# Altium schematic sheet uart.SchDoc
size A3
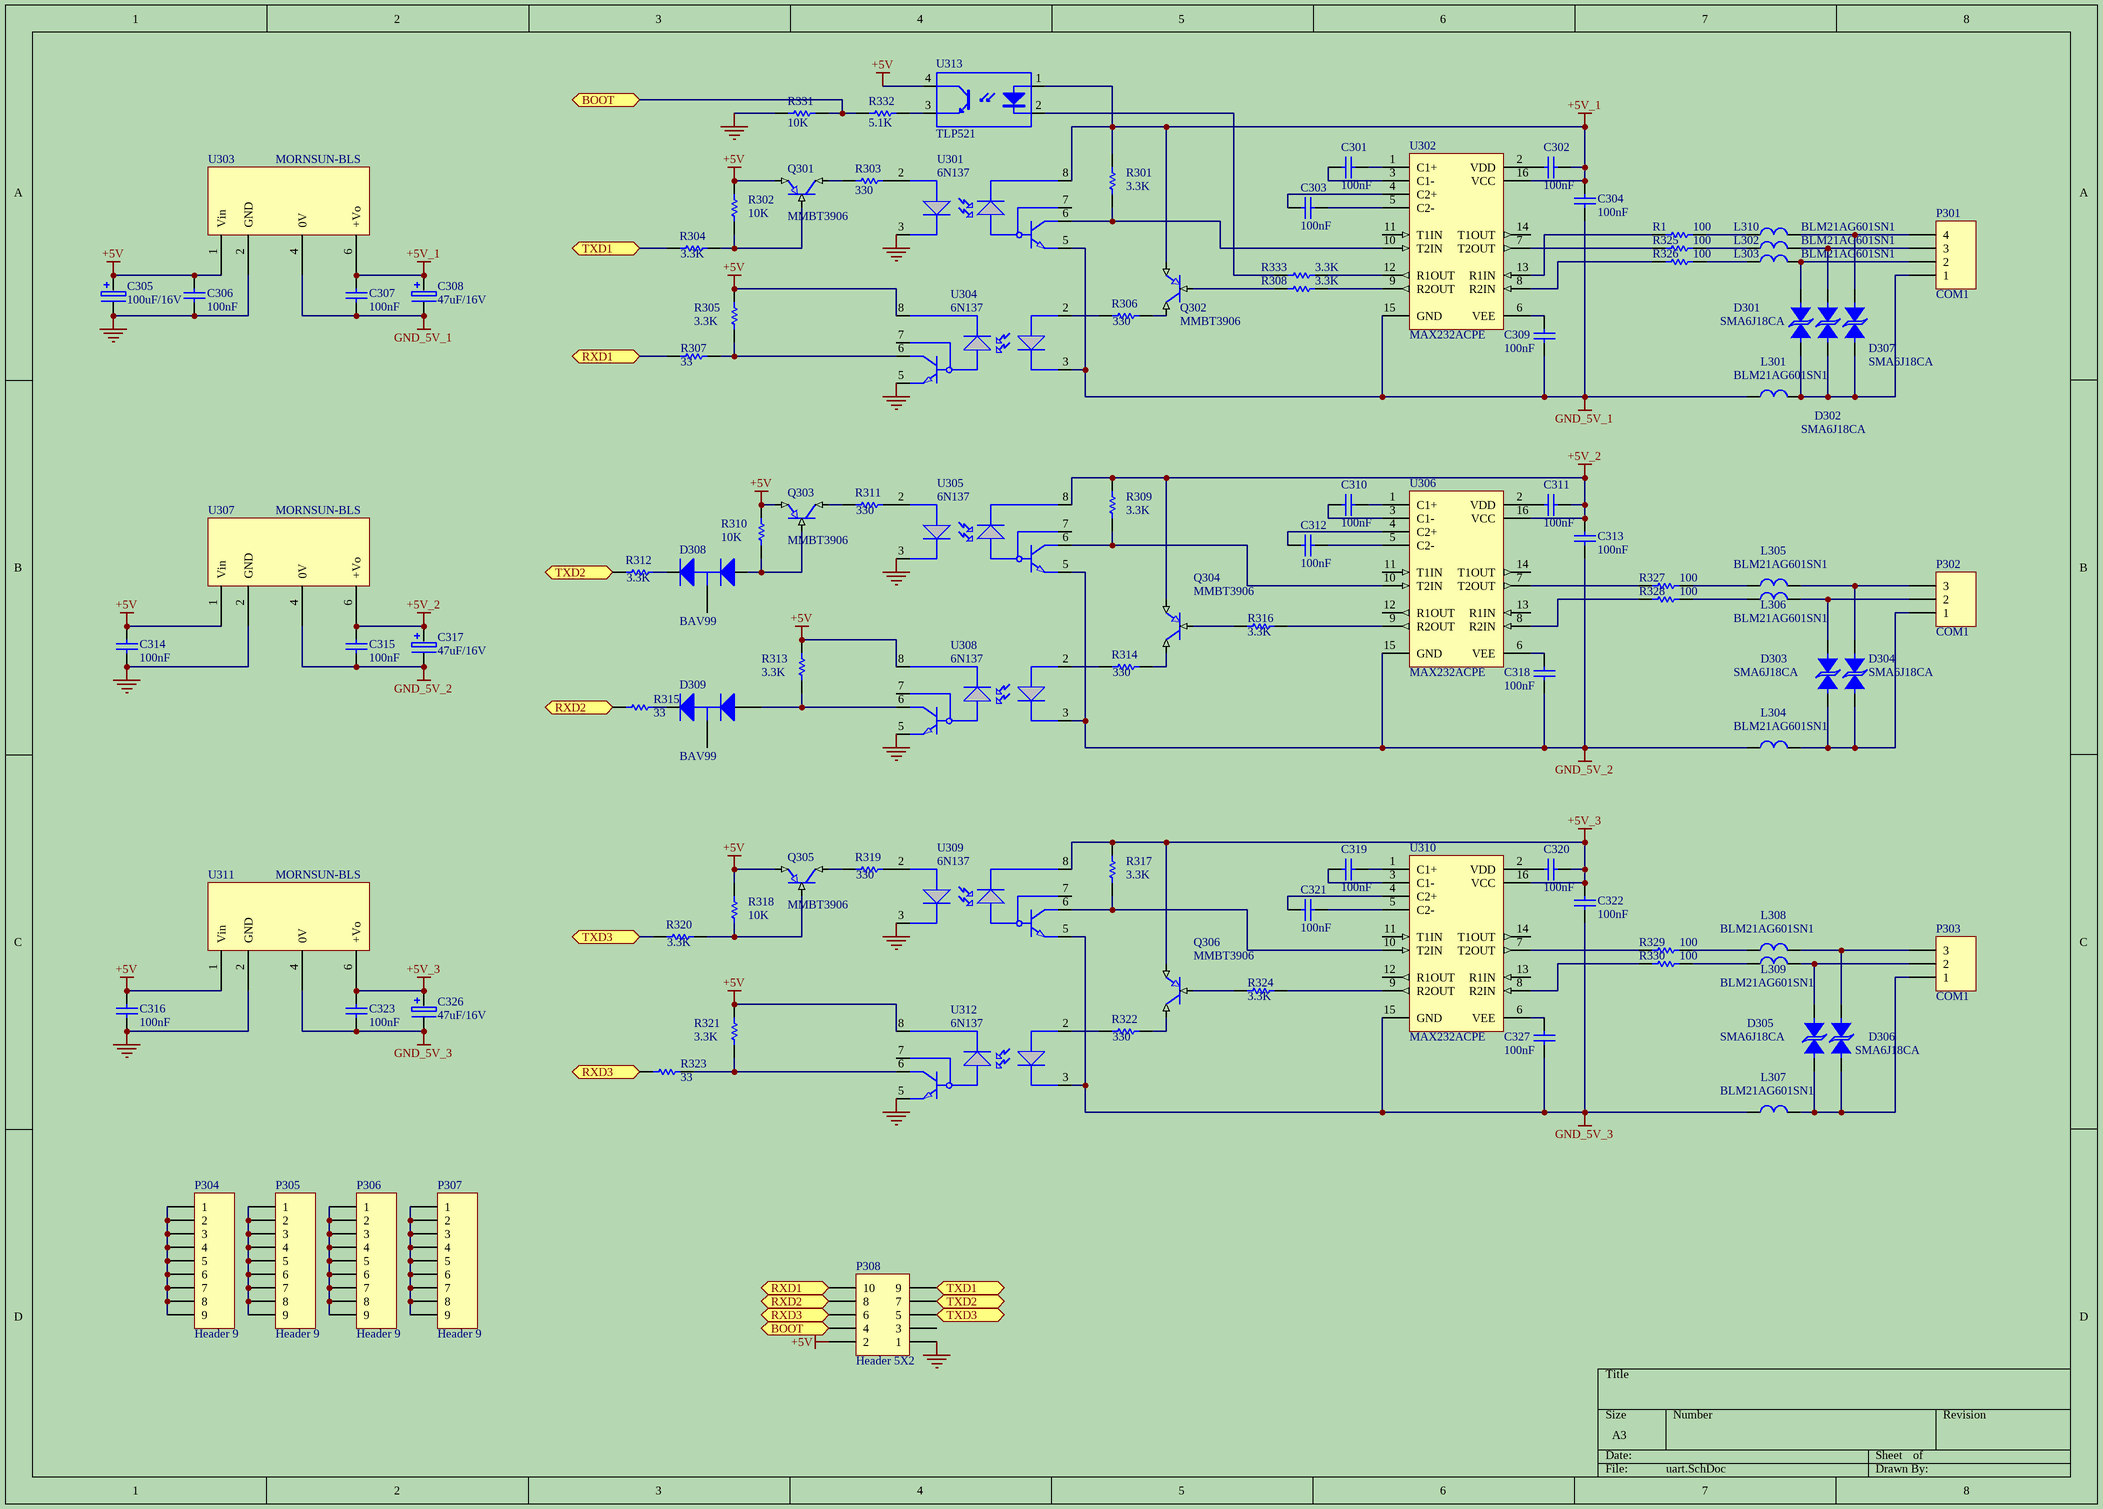
[diagram p0: uart.SchDoc]

## Parts
C301  100nF  [C0805]
C302  100nF  [C0805]
C303  100nF  [C0805]
C304  100nF  [C0805]
C305  100uF/16V  [CD1/2]
C306  100nF  [C0805]
C307  100nF  [C0805]
C308  47uF/16V  [CD1/2]
C309  100nF  [C0805]
C310  100nF  [C0805]
C311  100nF  [C0805]
C312  100nF  [C0805]
C313  100nF  [C0805]
C314  100nF  [C0805]
C315  100nF  [C0805]
C316  100nF  [C0805]
C317  47uF/16V  [CD1/2]
C318  100nF  [C0805]
C319  100nF  [C0805]
C320  100nF  [C0805]
C321  100nF  [C0805]
C322  100nF  [C0805]
C323  100nF  [C0805]
C326  47uF/16V  [CD1/2]
C327  100nF  [C0805]
D301  SMA6J18CA  [SMA]
D302  SMA6J18CA  [SMA]
D303  SMA6J18CA  [SMA]
D304  SMA6J18CA  [SMA]
D305  SMA6J18CA  [SMA]
D306  SMA6J18CA  [SMA]
D307  SMA6J18CA  [SMA]
D308  BAV99  [SOT-23]
D309  BAV99  [SOT-23]
L301  BLM21AG601SN1  [L0805]
L302  BLM21AG601SN1  [L0805]
L303  BLM21AG601SN1  [L0805]
L304  BLM21AG601SN1  [L0805]
L305  BLM21AG601SN1  [L0805]
L306  BLM21AG601SN1  [L0805]
L307  BLM21AG601SN1  [L0805]
L308  BLM21AG601SN1  [L0805]
L309  BLM21AG601SN1  [L0805]
L310  BLM21AG601SN1  [L0805]
P301  COM1  [TJC3-4A]
P302  COM1  [TJC3-3A]
P303  COM1  [TJC3-3A]
P304  Header 9  [LK]
P305  Header 9  [LK]
P306  Header 9  [LK]
P307  Header 9  [LK]
P308  Header 5X2  [IDC10-EJ]
Q301  MMBT3906  [SOT-23]
Q302  MMBT3906  [SOT-23]
Q303  MMBT3906  [SOT-23]
Q304  MMBT3906  [SOT-23]
Q305  MMBT3906  [SOT-23]
Q306  MMBT3906  [SOT-23]
R1  100  [R0805]
R301  3.3K  [R0805]
R302  10K  [R0805]
R303  330  [R0805]
R304  3.3K  [R0805]
R305  3.3K  [R0805]
R306  330  [R0805]
R307  33  [R0805]
R308  3.3K  [R0805]
R309  3.3K  [R0805]
R310  10K  [R0805]
R311  330  [R0805]
R312  3.3K  [R0805]
R313  3.3K  [R0805]
R314  330  [R0805]
R315  33  [R0805]
R316  3.3K  [R0805]
R317  3.3K  [R0805]
R318  10K  [R0805]
R319  330  [R0805]
R320  3.3K  [R0805]
R321  3.3K  [R0805]
R322  330  [R0805]
R323  33  [R0805]
R324  3.3K  [R0805]
R325  100  [R0805]
R326  100  [R0805]
R327  100  [R0805]
R328  100  [R0805]
R329  100  [R0805]
R330  100  [R0805]
R331  10K  [R0805]
R332  5.1K  [R0805]
R333  3.3K  [R0805]
U301  6N137  [DIP8]
U302  MAX232ACPE  [PE16A]
U303  MORNSUN-BLS  [MORNSUN-BLS]
U304  6N137  [DIP8]
U305  6N137  [DIP8]
U306  MAX232ACPE  [PE16A]
U307  MORNSUN-BLS  [MORNSUN-BLS]
U308  6N137  [DIP8]
U309  6N137  [DIP8]
U310  MAX232ACPE  [PE16A]
U311  MORNSUN-BLS  [MORNSUN-BLS]
U312  6N137  [DIP8]
U313  TLP521  [DIP4]

## Ports
BOOT, RXD1, RXD2, RXD3, TXD1, TXD2, TXD3

## Nets
+5V: C305.1 C306.1 C314.1 C316.1 P308.2 Q301.2(E) Q303.2(E) Q305.2(E) R302.2 R305.2 R310.2 R313.2 R318.2 R321.2 U303.1(Vin) U304.8 U307.1(Vin) U308.8 U311.1(Vin) U312.8 U313.4(C)
+5V_1: C302.1 C304.1 C307.1 C308.1 Q302.2(E) R301.1 U301.8 U302.16(VCC) U303.6(+Vo) U313.1(A)
+5V_2: C311.1 C313.1 C315.1 C317.1 Q304.2(E) R309.1 U305.8 U306.16(VCC) U307.6(+Vo)
+5V_3: C320.1 C322.1 C323.1 C326.1 Q306.2(E) R317.1 U309.8 U310.16(VCC) U311.6(+Vo)
GND: C305.2 C306.2 C314.2 C316.2 P308.1 R331.1 U301.3 U303.2(GND) U304.5 U305.3 U307.2(GND) U308.5 U309.3 U311.2(GND) U312.5
GND_5V_1: C304.2 C307.2 C308.2 C309.1 L301.1 U301.5 U302.15(GND) U303.4(0V) U304.3
GND_5V_2: C313.2 C315.2 C317.2 C318.1 L304.1 U305.5 U306.15(GND) U307.4(0V) U308.3
GND_5V_3: C322.2 C323.2 C326.2 C327.1 L307.1 U309.5 U310.15(GND) U311.4(0V) U312.3
BOOT: P308.4 R331.2 R332.1 ; port BOOT
RXD1: P308.10 R307.2 ; port RXD1
RXD2: P308.8 R315.2 ; port RXD2
RXD3: P308.6 R323.2 ; port RXD3
TXD1: P308.9 R304.1 ; port TXD1
TXD2: P308.7 R312.1 ; port TXD2
TXD3: P308.5 R320.1 ; port TXD3
NetC301_1: C301.1 U302.1(C1+)
NetC301_2: C301.2 U302.3(C1-)
NetC302_2: C302.2 U302.2(VDD)
NetC303_1: C303.1 U302.5(C2-)
NetC303_2: C303.2 U302.4(C2+)
NetC309_2: C309.2 U302.6(VEE)
NetC310_1: C310.1 U306.1(C1+)
NetC310_2: C310.2 U306.3(C1-)
NetC311_2: C311.2 U306.2(VDD)
NetC312_1: C312.1 U306.5(C2-)
NetC312_2: C312.2 U306.4(C2+)
NetC318_2: C318.2 U306.6(VEE)
NetC319_1: C319.1 U310.1(C1+)
NetC319_2: C319.2 U310.3(C1-)
NetC320_2: C320.2 U310.2(VDD)
NetC321_1: C321.1 U310.5(C2-)
NetC321_2: C321.2 U310.4(C2+)
NetC327_2: C327.2 U310.6(VEE)
NetD301_1: D301.1(ANODE) D302.1(ANODE) D307.1(ANODE) L301.2 P301.1
NetD301_2: D301.2(CATHODE) L303.2 P301.2
NetD302_2: D302.2(CATHODE) L302.2 P301.3
NetD303_1: D303.1(ANODE) D304.1(ANODE) L304.2 P302.1
NetD303_2: D303.2(CATHODE) L306.2 P302.2
NetD304_2: D304.2(CATHODE) L305.2 P302.3
NetD305_1: D305.1(ANODE) D306.1(ANODE) L307.2 P303.1
NetD305_2: D305.2(CATHODE) L309.2 P303.2
NetD306_2: D306.2(CATHODE) L308.2 P303.3
NetD307_2: D307.2(CATHODE) L310.2 P301.4
NetD308_1: D308.1(A) Q303.1(B) R310.1
NetD308_2: D308.2(K) R312.2
NetD309_1: D309.1(A) R313.1 U308.6
NetD309_2: D309.2(K) R315.1
NetL302_1: L302.1 R325.1
NetL303_1: L303.1 R326.1
NetL305_1: L305.1 R327.1
NetL306_1: L306.1 R328.1
NetL308_1: L308.1 R329.1
NetL309_1: L309.1 R330.1
NetL310_1: L310.1 R1.1
NetP304_1: P304.1 P304.2 P304.3 P304.4 P304.5 P304.6 P304.7 P304.8 P304.9
NetP305_1: P305.1 P305.2 P305.3 P305.4 P305.5 P305.6 P305.7 P305.8 P305.9
NetP306_1: P306.1 P306.2 P306.3 P306.4 P306.5 P306.6 P306.7 P306.8 P306.9
NetP307_1: P307.1 P307.2 P307.3 P307.4 P307.5 P307.6 P307.7 P307.8 P307.9
NetQ301_1: Q301.1(B) R302.1 R304.2
NetQ301_3: Q301.3(C) R303.1
NetQ302_1: Q302.1(B) R308.1
NetQ302_3: Q302.3(C) R306.1
NetQ303_3: Q303.3(C) R311.2
NetQ304_1: Q304.1(B) R316.1
NetQ304_3: Q304.3(C) R314.1
NetQ305_1: Q305.1(B) R318.1 R320.2
NetQ305_3: Q305.3(C) R319.2
NetQ306_1: Q306.1(B) R324.1
NetQ306_3: Q306.3(C) R322.1
NetR1_2: R1.2 U302.13(R1IN)
NetR301_2: R301.2 U301.6 U302.10(T2IN)
NetR303_2: R303.2 U301.2
NetR305_1: R305.1 R307.1 U304.6
NetR306_2: R306.2 U304.2
NetR308_2: R308.2 U302.9(R2OUT)
NetR309_2: R309.2 U305.6 U306.10(T2IN)
NetR311_1: R311.1 U305.2
NetR314_2: R314.2 U308.2
NetR316_2: R316.2 U306.9(R2OUT)
NetR317_2: R317.2 U309.6 U310.10(T2IN)
NetR319_1: R319.1 U309.2
NetR321_1: R321.1 R323.1 U312.6
NetR322_2: R322.2 U312.2
NetR324_2: R324.2 U310.9(R2OUT)
NetR325_2: R325.2 U302.7(T2OUT)
NetR326_2: R326.2 U302.8(R2IN)
NetR327_2: R327.2 U306.7(T2OUT)
NetR328_2: R328.2 U306.8(R2IN)
NetR329_2: R329.2 U310.7(T2OUT)
NetR330_2: R330.2 U310.8(R2IN)
NetR332_2: R332.2 U313.3(E)
NetR333_1: R333.1 U313.2(K)
NetR333_2: R333.2 U302.12(R1OUT)

Not connected (* = marked no-connect by the designer): D308 3(C); D309 3(C); P308 3; U301 7; U302 11(T1IN) 14(T1OUT); U304 7; U305 7; U306 11(T1IN) 12(R1OUT) 13(R1IN) 14(T1OUT); U308 7; U309 7; U310 11(T1IN) 12(R1OUT) 13(R1IN) 14(T1OUT); U312 7

## Library data of the parts
C301-C304 C306 C307 C309-C316 C318-C323 C327 = Cap: Capacitor; Published: 8-Jun-2000; LatestRevisionDate: 17-Jul-2002; LatestRevisionNote: Re-released for DXP Platform.; PackageReference: RAD-0.3; Publisher: Altium Limited; Value: 100nF
C305 C308 C317 C326 = CD1: Electrolytic Capacitor; Text Field1: 4.7uF:4V-A;6.3V-A;10V-A;16V-BA;20V-BA;25V-CB;35V-DC;50V-D;; Text Field2: 10uF:4V-AB;6.3V-BA;10V-BA;16V-CBA;20V-CB;25V-DC;35V-D;; Text Field3: 22uF:4V-BA;6.3V-CBA;10V-CB;16V-DBC;20V-DC;25V-D;35V-D;; Text Field4: 33uF:4V-CAB;6.3V-CBA;10V-DBC;16V-DCB;20V-DC;25V-DE;; Text Field5: 47uF:4V-CBA;6.3V-DBC;10V-DBC;16V-DC;20V-DE;; Text Field6: 68uF:4V-DBC;6.3V-DCB;10V-DCB;16V-D;20V-DE;; Text Field7: 100uF:4V-DCB;6.3V-EDBC;10V-DC;16V-DE;20V-E;; Text Field8: 220uF:4V-EDC;6.3V-ED;10V-ED;
D301-D307 = Bidirectional DIODE TVS: 1V5KE6V8CA
D308 D309 = BAV99: Silicon Switching Diode Array for High-Speed Switching; Published: 21-Mar-2003; DatasheetDocument: Oct-1999; PackageDocument: Sep-2001; PackageReference: SOT-23; Publisher: Altium Limited; ComponentLink1Description: Manufacturer Link; ComponentLink1URL: http://www.infineon.com/; ComponentLink2Description: Datasheet; ComponentLink2URL: http://www.infineon.com/upload/Document/cmc_upload/documents/080/631/bav99series_1.pdf
L301-L310 = L1
P301 = Header 4: Header, 4-Pin; LatestRevisionDate: 17-Jul-2002; LatestRevisionNote: Re-released for DXP Platform.; Publisher: Altium Limited
P302 P303 = Header 3: Header, 3-Pin; LatestRevisionDate: 17-Jul-2002; LatestRevisionNote: Re-released for DXP Platform.; Publisher: Altium Limited
P304-P307 = Header 9: Header, 9-Pin; LatestRevisionDate: 17-Jul-2002; LatestRevisionNote: Re-released for DXP Platform.; Publisher: Altium Limited
P308 = Header 5X2: Header, 5-Pin, Dual row; LatestRevisionDate: 17-Jul-2002; LatestRevisionNote: Re-released for DXP Platform.; Publisher: Altium Limited
Q301-Q306 = PNP_SOT23: PNP Transistor
R1 R325-R332 = Res1: Resistor; Value: 330; Published: 8-Jun-2000; LatestRevisionDate: 17-Jul-2002; LatestRevisionNote: Re-released for DXP Platform.; PackageReference: AXIAL-0.3; Publisher: Altium Limited
R301 R305 R307 R309 R313 R315 R317 R321 R323 = Res1: Resistor; Value: 10K; Published: 8-Jun-2000; LatestRevisionDate: 17-Jul-2002; LatestRevisionNote: Re-released for DXP Platform.; PackageReference: AXIAL-0.3; Publisher: Altium Limited
R302 R303 R306 R310 R311 R314 R318 R319 R322 = Res1: Resistor; Published: 8-Jun-2000; LatestRevisionDate: 17-Jul-2002; LatestRevisionNote: Re-released for DXP Platform.; PackageReference: AXIAL-0.3; Publisher: Altium Limited
  R302 R310 R318: Value: 10K
  R303 R306 R311 R314 R319 R322: Value: 330
R304 R308 R312 R316 R320 R324 R333 = Res1: Resistor; Value: 5.1K; Published: 8-Jun-2000; LatestRevisionDate: 17-Jul-2002; LatestRevisionNote: Re-released for DXP Platform.; PackageReference: AXIAL-0.3; Publisher: Altium Limited
U301 U304 U305 U308 U309 U312 = 6N136: Text Field1: 110; Text Field2: 50
U302 U306 U310 = MAX232ACPE: +5V Powered, Multi-Channel RS-232 Driver/Receiver; Published: 16-Jan-2001; LatestRevisionDate: 29-May-2009; LatestRevisionNote: Component Body Added.; PackageVersion: 1997; PackageReference: PE16A; Publisher: Altium Limited; PackageDescription: DIP, 16-Pin, Row Spacing 7.62 mm, Pitch 2.54 mm; Code_JEDEC: MS-001-BB; ComponentLink1Description: Manufacturer Link; ComponentLink1URL: http://www.maxim-ic.com/; ComponentLink2Description: Datasheet; ComponentLink2URL: http://pdfserv.maxim-ic.com/en/ds/MAX220-MAX249.pdf
U303 U307 U311 = MORNSUN-BLS: MORNSUN Fixed input,Isolated,Unregulated Series DC/DC
U313 = TLP521: Text Field1: 80; Text Field2: 50